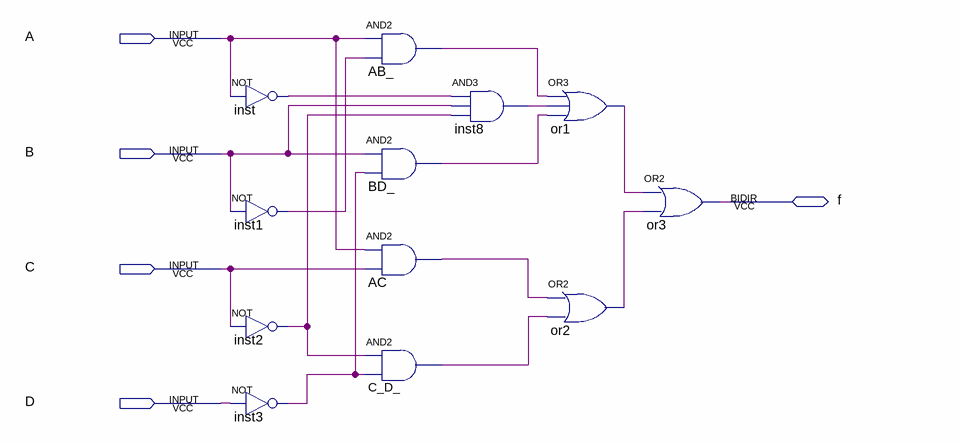
[diagram p0: schematic sheet]
// Quartus schematic output_f.bdf as structural Verilog: 12 symbols, 5 pins
module output_f (
  input  A,
  input  B,
  input  C,
  input  D,
  inout  f
);

  wire AB__out, AC_out, BD__out, C_D__out, inst1_out, inst2_out, inst3_out, inst8_out, inst_out, or1_out,
       or2_out;

  not inst (inst_out, A);
  not inst1 (inst1_out, B);
  not inst2 (inst2_out, C);
  not inst3 (inst3_out, D);
  and AB_ (AB__out, A, inst1_out);
  and BD_ (BD__out, B, inst3_out);
  and AC (AC_out, A, C);
  and C_D_ (C_D__out, inst2_out, inst3_out);
  and inst8 (inst8_out, inst_out, B, inst2_out);
  or or1 (or1_out, AB__out, inst8_out, BD__out);
  or or2 (or2_out, AC_out, C_D__out);
  or or3 (f, or1_out, or2_out);
endmodule
